# Altium schematic sheet 2d_list_2.schdoc
size 420 x 594 mm
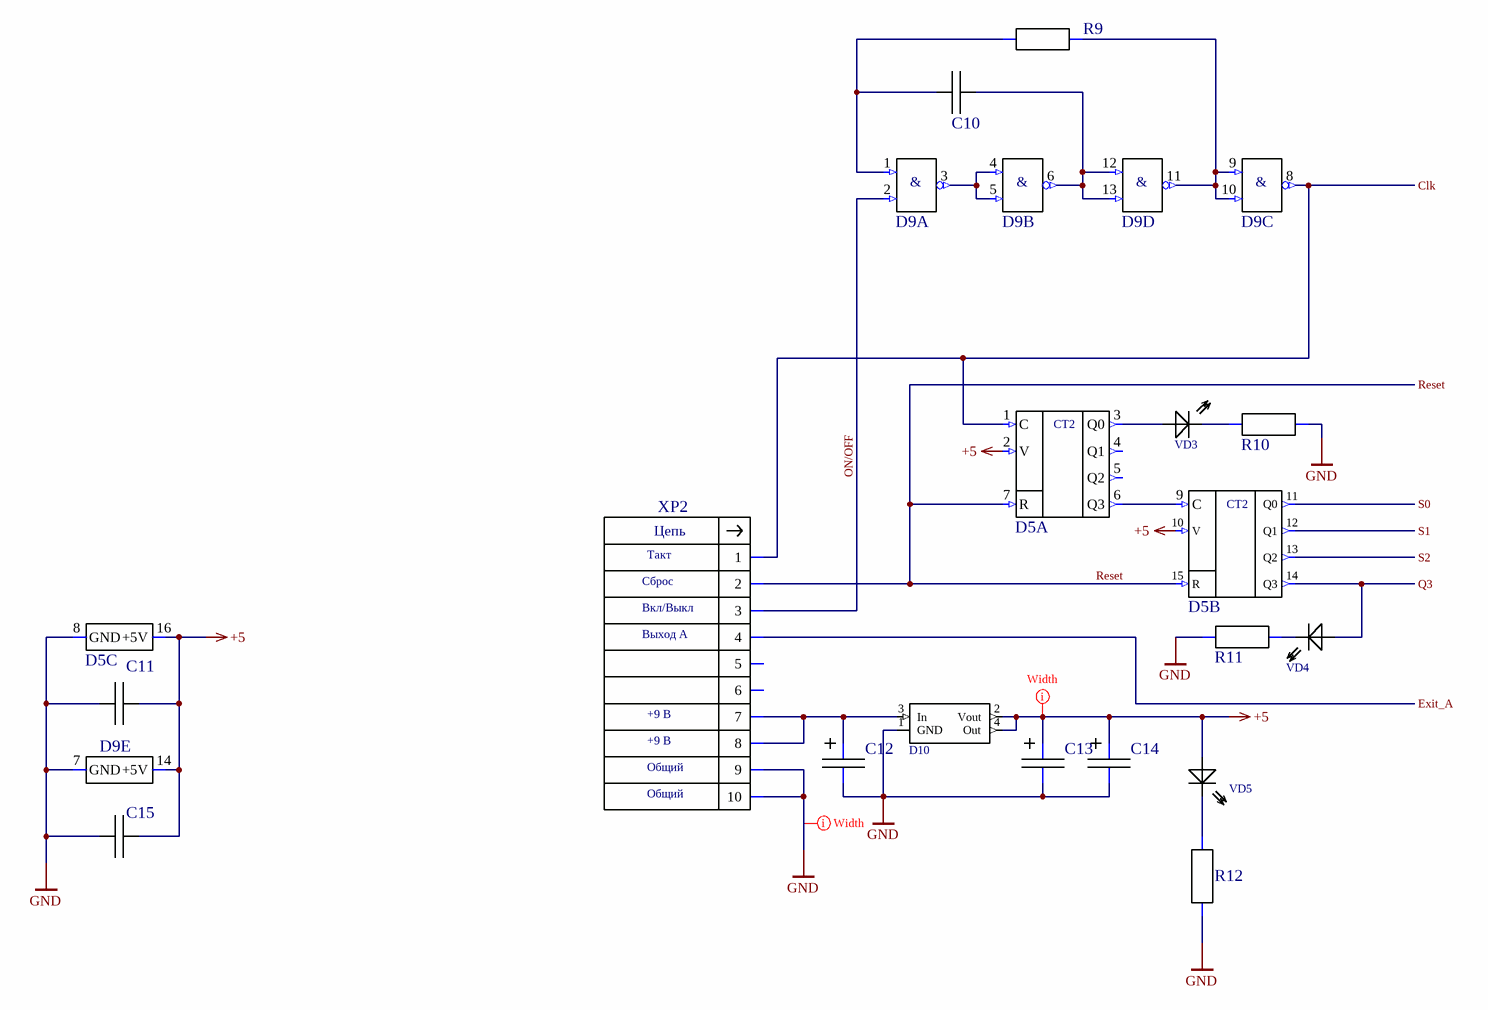
[diagram p0: 2d_list_2.schdoc]

## Parts
C10  3224 (8х6мм)  [K10-79_8_6(3224)]  (value not drawn)
C11  1206  [K10-79_3.2_1.6(1206)]  (value not drawn)
C12  C  [C-Tantal]  (value not drawn)
C13  C  [C-Tantal]  (value not drawn)
C14  C  [C-Tantal]  (value not drawn)
C15  1206  [K10-79_3.2_1.6(1206)]  (value not drawn)
D5  (no value)  [DIP16]  (parts A,B,C of 3)
D9  74AC00PC  [DIP14]  (value not drawn)  (parts A,B,C,D,E of 5)
D10  Микросхема  [SOT230P700X180-4N]  (value not drawn)
R9  (no value)  [RES_1206_3216_N]
R10  (no value)  [RES_0603_1608_N]
R11  (no value)  [RES_0603_1608_N]
R12  (no value)  [RES_0603_1608_N]
VD3  светодиод  [521-9466]  (value not drawn)
VD4  светодиод  [521-9466]  (value not drawn)
VD5  светодиод  [521-9466]  (value not drawn)
XP2  TE_1-1634689-0  [BH-10R]  (value not drawn)

## Ports
Clk, Exit_A, Q3, Reset, S0, S1, S2

## Nets
+5: C11.2 C13.+ C14.+ C15.2 D5.2(V) D5.10(V) D5.16(+5V) D9.14(+5V) D10.2(Vout) D10.4(Out) VD5.A
GND: C11.1 C12.- C13.- C14.- C15.1 D5.8(GND) D9.7(GND) D10.1(GND) R10.2 R11.1 R12.1 XP2.9 XP2.10
Clk: D5.1(C) D9.8(Out) XP2.1 ; port Clk
Exit_A: XP2.4 ; port Exit_A
ON/OFF: D9.2(In2) XP2.3
Q3: D5.14(Q3) VD4.A ; port Q3
Reset: D5.7(R) D5.15(R) XP2.2 ; port Reset
S0: D5.11(Q0) ; port S0
S1: D5.12(Q1) ; port S1
S2: D5.13(Q2) ; port S2
NetC10_1: C10.1 D9.1(In1) R9.1
NetC10_2: C10.2 D9.6(Out) D9.12(In1) D9.13(In2)
NetC12_+: C12.+ D10.3(In) XP2.7 XP2.8
NetD5_3: D5.3(Q0) VD3.A
NetD5_6: D5.6(Q3) D5.9(C)
NetD9_3: D9.3(Out) D9.4(In1) D9.5(In2)
NetD9_9: D9.9(In1) D9.10(In2) D9.11(Out) R9.2
NetR10_1: R10.1 VD3.KK
NetR11_2: R11.2 VD4.KK
NetR12_2: R12.2 VD5.KK

Not connected (* = marked no-connect by the designer): D5 4(Q1) 5(Q2); XP2 5 6

## Layout directives
mark named Width: +5, GND

## Notes on the sheet
- Такт
- Сброс
- Вкл/Выкл
- Выход А
- +9 В
- Общий
- Перв. примен.
- Справ. №
- Подп. дата
- Инв. № дубл.
- Взам. инв. №
- Подп. и дата
- Изм.
- Разраб.
- Лист
- № докум.
- Подп.
- Дата
- Лит.
- Масса
- Масштаб
- Пров.
- Т.контр.
- Листов
- Инв. № подл.
- Н.контр.
- Утв.
- ALTIUM GOSTBOM2.0 KEV
- Файл:
- Копировал
- Формат А2
- (in symbol 74AC00PC, part A) &
- (in symbol 74AC00PC, part B) &
- (in symbol 74AC00PC, part C) &
- (in symbol 74AC00PC, part D) &
- (in symbol MC14520BCP, part A) CT2
- (in symbol MC14520BCP, part B) CT2
- (in symbol TE_1-1634689-0) Цепь

## Library data of the parts
C10 = К10-79_3224_МП0: Чип конденсатор 3224 МП0 ряд Е24; Manufacturer: ООО "Кулон"; Name: Конденсатор К10-79; Reliability: 0.000005; Permit MPSU: разрешен; LiveStatus: производится; Packing: катушка; LibraryEngeneer: Желобаев; Tolerance: ±5%; Datum: 6_01_2019; TU: АЖЯР.673511.004 ТУ; Type: K10-79; Hight: 3,00; BOM: Конденсатор К10-79-*-B-*±5%-МП0 АЖЯР.673511.004 ТУ; Version: 00; HelpURL: \\papa\Info\Altium_Library\Даташиты_и_ТУ\Конденсаторы_отечественные\К10-79_АЖЯР_673511_004ТУ.pdf; Weight: 0.8; Voltage: *; TKE: МП0; Size: 3224 (8х6мм); Value: *; Value_KD: *
C11 C15 = К10-79_1206_Н90: Чип конденсатор 1206 Н90 ряд Е6; Manufacturer: ООО "Кулон"; Name: Конденсатор К10-79; Reliability: 0.000005; Permit MPSU: разрешен; LiveStatus: производится; Packing: катушка; LibraryEngeneer: Желобаев; Tolerance: +80%-20%; Datum: 19_12_2018; TU: АЖЯР.673511.004 ТУ; Type: K10-79; Hight: 1.6; BOM: Конденсатор К10-79-*-B-*+80%-20%-Н90 АЖЯР.673511.004 ТУ; Version: 00; HelpURL: \\papa\Info\Altium_Library\Даташиты_и_ТУ\Конденсаторы_отечественные\К10-79_АЖЯР_673511_004ТУ.pdf; Weight: 0.15; Voltage: *; TKE: Н90; Size: 1206; Value: *; Value_KD: *
C12-C14 = K53-65_C_10%: К53-65 Конденсатор танталовый C(6032) 0,47-100 мкФ; Manufacturer: ОАО "Элеконд"; TU: АЖЯР.673546.004 ТУ; Tolerance: 10%; Created_by: Желобаев; BOM: К53-65 "C" - *B - *мкФ ±10% АЖЯР.673546.004 ТУ; Name2: Конденсатор К53-65; Value: *; Voltage: *; Weight: 0,3; Version: 0; Issue_date: 6.01.2019; Size: C; Name: К53-65; Case: C
D5 = MC14520BCP: Два двоичных счетчика; Manufacturer: Motorola; Created_by: Желобаев; BOM: MC14520BCP "Motorola"; Name2: Микросхема MC14520BCP; Issue_date: 6.01.2019; Version: 0; Name: MC14520BCP; Case: DIP-16
D9 = 74AC00PC: 4 элемента 2И-НЕ TTL PDIP-14; Manufacturer: ON Semiconductor; BOM: 74AC00PC "ON Semiconductor"; Created_by: Желобаев; Power_Voltage: 4.5 - 5.5 V; Name2: Микросхема 74AC00PC; Issue_date: 10.04.2019; Case: DIP-14; Name: 74AC00PC; Version: 0
D10 = LM1117IMP-5.0/NOPB
R9 = Р1-12-0,25-5%: Резистор от 0,75 Ом до 2,2 МОм; Manufacturer: ОАО "НПО "Эркон"; Tolerance: 5%; TU: АЛЯР.434110.005 ТУ; Voltage: 150; TKR: M; BOM: Р1-12-0,25 * 5%-M-"A" АЛЯР.434110.005 ТУ; Created_by: Желобаев; Name2: Резистор Р1-12-0,25; Version: 00; Type: Р1-12-0,25±5%-М-"А"; Weight: 0,015; Size: 1206; Name: Р1-12-0,25; Value_KD: *; Issue_date: 10.04.2019; Case: 1206
R10-R12 = Р1-12-0,1-5%: Резистор от 0,75 Ом до 10 МОм; Manufacturer: ОАО "НПО "Эркон"; Tolerance: 5%; TU: АЛЯР.434110.005 ТУ; Voltage: 50; TKR: M; BOM: Р1-12-0,1 * 5%-M-"A" АЛЯР.434110.005 ТУ; Created_by: Желобаев; Name2: Резистор Р1-12-0,1; Version: 00; Type: Р1-12-0,1±5%-М-"А"; Weight: 0,005; Size: 0603; Name: Р1-12-0,1; Value_KD: *; Issue_date: 10.04.2019; Case: 0603
VD3-VD5 = 521-9466
XP2 = TE_1-1634689-0: Вилка типа BH-10R угловая правая двухрядная 2х5х2.54; Manufacturer: TE Connectivity; Created_by: Желобаев; BOM: TE_1-1634689-0 "TE Connectivity"; Name2: Вилка угловая TE_1-1634689-0; Name: TE_1-1634689-0; Issue_date: 13.05.2019; Version: 0; Case: BH-10R